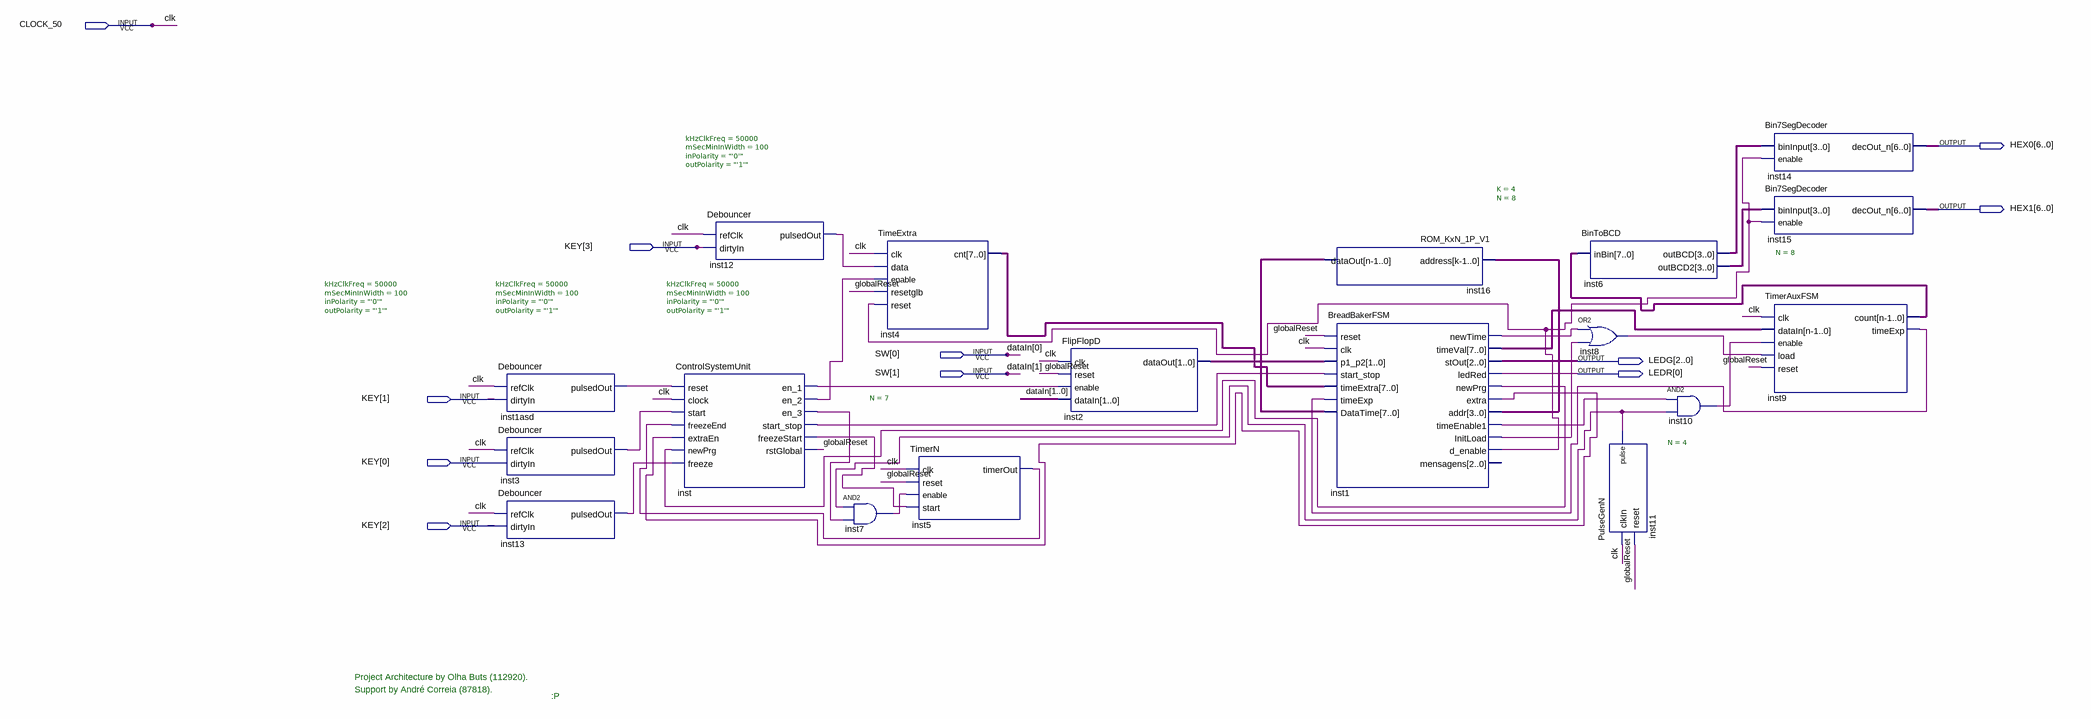
[diagram p0: schematic sheet]
// Quartus schematic BreadMaker.bdf as structural Verilog: 18 symbols, 11 pins
module BreadMaker (
  input  CLOCK_50,
  input  [3:0] KEY,
  input  [1:0] SW,
  output [6:0] HEX0,
  output [6:0] HEX1,
  output [2:0] LEDG,
  output [0:0] LEDR
);

  wire globalReset, inst1_d_enable, inst1_extra, inst1_initload, inst1_newprg, inst1_newtime,
       inst1_timeenable1, inst1asd_pulsedout, inst3_pulsedout, inst5_timerout, inst7_out, inst8_out,
       inst9_timeexp, inst10_out, inst11_pulse, inst12_pulsedout, inst13_pulsedout, inst_en_1, inst_en_2,
       inst_en_3, inst_freezestart, inst_start_stop;
  wire [1:0] inst2_dataout;
  wire [3:0] inst1_addr, inst6_outbcd, inst6_outbcd2;
  wire [7:0] inst1_timeval, inst4_cnt, inst9_count, inst16_dataout;

  Debouncer #(.kHzClkFreq(50000), .mSecMinInWidth(100), .inPolarity("'0'"), .outPolarity("'1'")) inst1asd (
    .refClk(CLOCK_50), .dirtyIn(KEY[1]), .pulsedOut(inst1asd_pulsedout));
  Debouncer #(.kHzClkFreq(50000), .mSecMinInWidth(100), .inPolarity("'0'"), .outPolarity("'1'")) inst3 (
    .refClk(CLOCK_50), .dirtyIn(KEY[0]), .pulsedOut(inst3_pulsedout));
  Debouncer #(.kHzClkFreq(50000), .mSecMinInWidth(100), .inPolarity("'0'"), .outPolarity("'1'")) inst13 (
    .refClk(CLOCK_50), .dirtyIn(KEY[2]), .pulsedOut(inst13_pulsedout));
  Debouncer #(.kHzClkFreq(50000), .mSecMinInWidth(100), .inPolarity("'0'"), .outPolarity("'1'")) inst12 (
    .refClk(CLOCK_50), .dirtyIn(KEY[3]), .pulsedOut(inst12_pulsedout));
  ControlSystemUnit inst (
    .reset(inst1asd_pulsedout), .clock(CLOCK_50), .start(inst3_pulsedout), .freezeEnd(inst5_timerout),
    .extraEn(inst1_extra), .newPrg(inst1_newprg), .freeze(inst13_pulsedout), .en_1(inst_en_1),
    .en_2(inst_en_2), .en_3(inst_en_3), .start_stop(inst_start_stop), .freezeStart(inst_freezestart),
    .rstGlobal(globalReset));
  and inst7 (inst7_out, inst11_pulse, inst_en_3);
  TimeExtra inst4 (
    .clk(CLOCK_50), .data(inst12_pulsedout), .enable(inst_en_2), .resetglb(globalReset),
    .reset(inst1_d_enable), .cnt(inst4_cnt));
  TimerN #(.N(7)) inst5 (
    .clk(CLOCK_50), .reset(globalReset), .enable(inst7_out), .start(inst_freezestart),
    .timerOut(inst5_timerout));
  FlipFlopD inst2 (.clk(CLOCK_50), .reset(globalReset), .enable(inst_en_1), .dataIn(SW), .dataOut(inst2_dataout));
  ROM_KxN_1P_V1 #(.K(4), .N(8)) inst16 (.address(inst1_addr), .dataOut(inst16_dataout));
  BreadBakerFSM inst1 (
    .reset(globalReset), .clk(CLOCK_50), .p1_p2(inst2_dataout), .start_stop(inst_start_stop),
    .timeExtra(inst4_cnt), .timeExp(inst9_timeexp), .DataTime(inst16_dataout), .newTime(inst1_newtime),
    .timeVal(inst1_timeval), .stOut(LEDG), .ledRed(LEDR[0]), .newPrg(inst1_newprg), .extra(inst1_extra),
    .addr(inst1_addr), .timeEnable1(inst1_timeenable1), .InitLoad(inst1_initload), .d_enable(inst1_d_enable));  // open: mensagens
  BinToBCD inst6 (.inBin(inst9_count), .outBCD(inst6_outbcd), .outBCD2(inst6_outbcd2));
  or inst8 (inst8_out, inst1_newtime, inst1_initload);
  PulseGenN #(.N(4)) inst11 (.clkIn(CLOCK_50), .reset(globalReset), .pulse(inst11_pulse));
  and inst10 (inst10_out, inst1_timeenable1, inst11_pulse);
  Bin7SegDecoder inst14 (.binInput(inst6_outbcd), .enable(inst1_d_enable), .decOut_n(HEX0));
  Bin7SegDecoder inst15 (.binInput(inst6_outbcd2), .enable(inst1_d_enable), .decOut_n(HEX1));
  TimerAuxFSM #(.N(8)) inst9 (
    .clk(CLOCK_50), .dataIn(inst1_timeval), .enable(inst10_out), .load(inst8_out), .reset(globalReset),
    .count(inst9_count), .timeExp(inst9_timeexp));

  // Other names for the same wires on the sheet: clk = CLOCK_50; dataIn[1:0] = SW

  // Notes on the sheet:
  //   Project Architecture by Olha Buts (112920).
  //   Support by André Correia (87818).
  //   :P
endmodule
